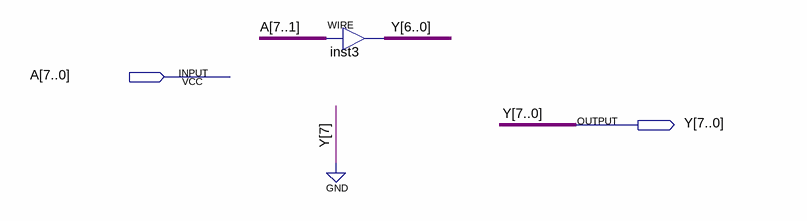
[diagram p0: schematic sheet]
// Quartus schematic or8bit.bdf as structural Verilog: 1 symbols, 2 pins
module or8bit (
  input  [7:0] A,
  output [7:0] Y
);

  assign Y[6:0] = A[7:1];  // WIRE inst3

  assign Y[7] = 1'b0;
endmodule
